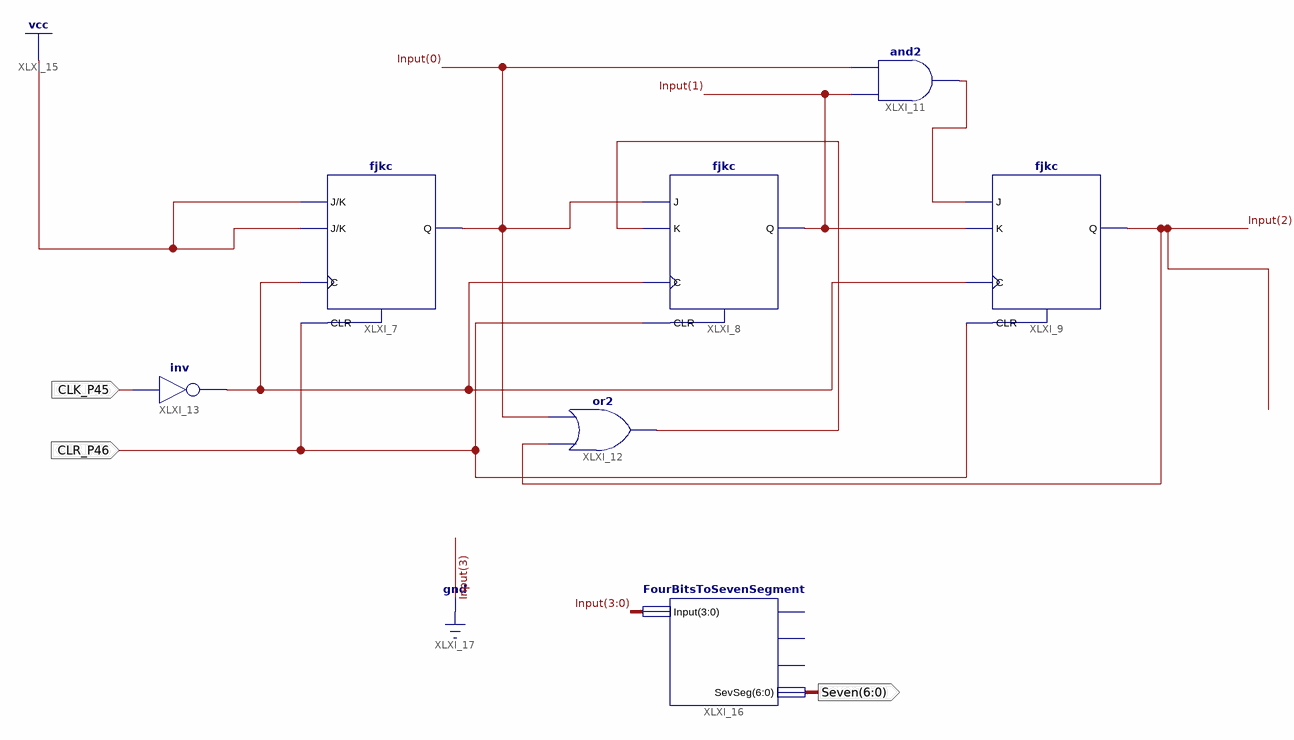
[diagram p0: schematic sheet 1]
// Xilinx ISE schematic Count.sch (spartan6) as structural Verilog: 7 symbols, 3 ports
module Count (
  input  CLR_P46,
  input  CLK_P45,
  output [6:0] Seven
);

  wire XLXN_24, XLXN_31, XLXN_34;
  wire [2:0] Input;

  fjkc XLXI_7 (.C(XLXN_34), .CLR(CLR_P46), .J(1'b1), .K(1'b1), .Q(Input[0]));
  fjkc XLXI_8 (.C(XLXN_34), .CLR(CLR_P46), .J(Input[0]), .K(XLXN_31), .Q(Input[1]));
  fjkc XLXI_9 (.C(XLXN_34), .CLR(CLR_P46), .J(XLXN_24), .K(Input[1]), .Q(Input[2]));
  and XLXI_11 (XLXN_24, Input[1], Input[0]);
  or XLXI_12 (XLXN_31, Input[2], Input[0]);
  not XLXI_13 (XLXN_34, CLK_P45);
  FourBitsToSevenSegment XLXI_16 (.Input({1'b0, Input}), .SevSeg(Seven));  // open: COMMON1, COMMON2, COMMON3

  // Notes on the sheet:
  //   CLOCK_DEDICATED_ROUTE on signal CLK_P45 = TRUE
endmodule
